# EasyEDA Pro project ProPrj_逆变电路（单相三相）_2026-01-25.epro, board PCB1_2
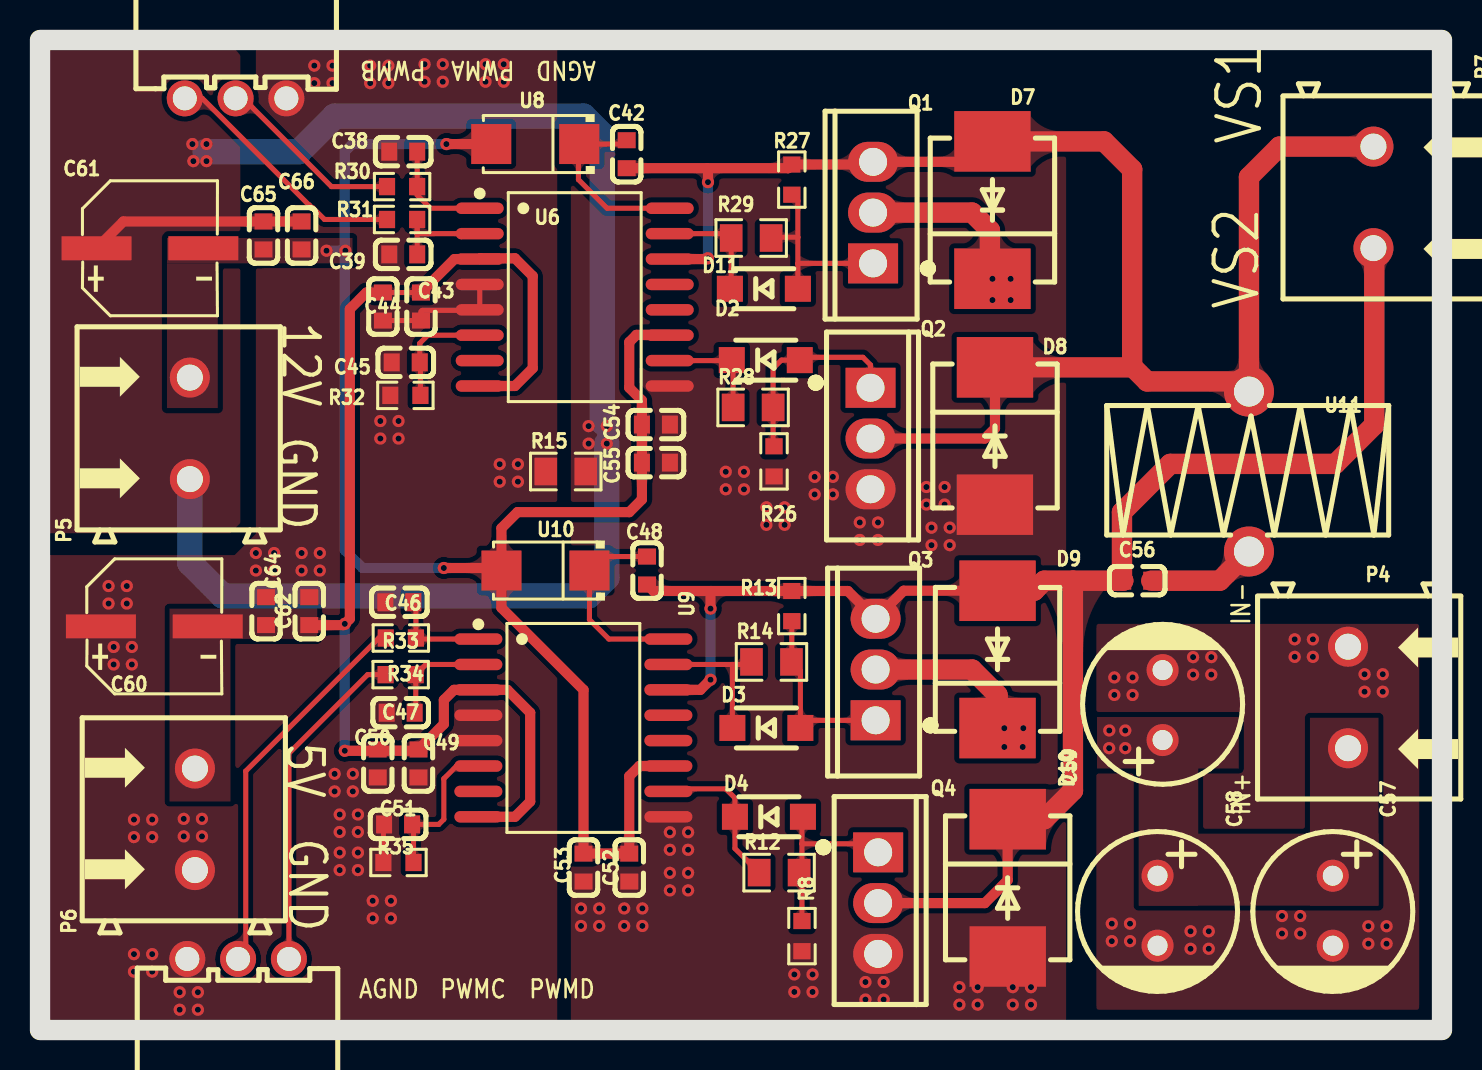
[diagram p7: board, top side]
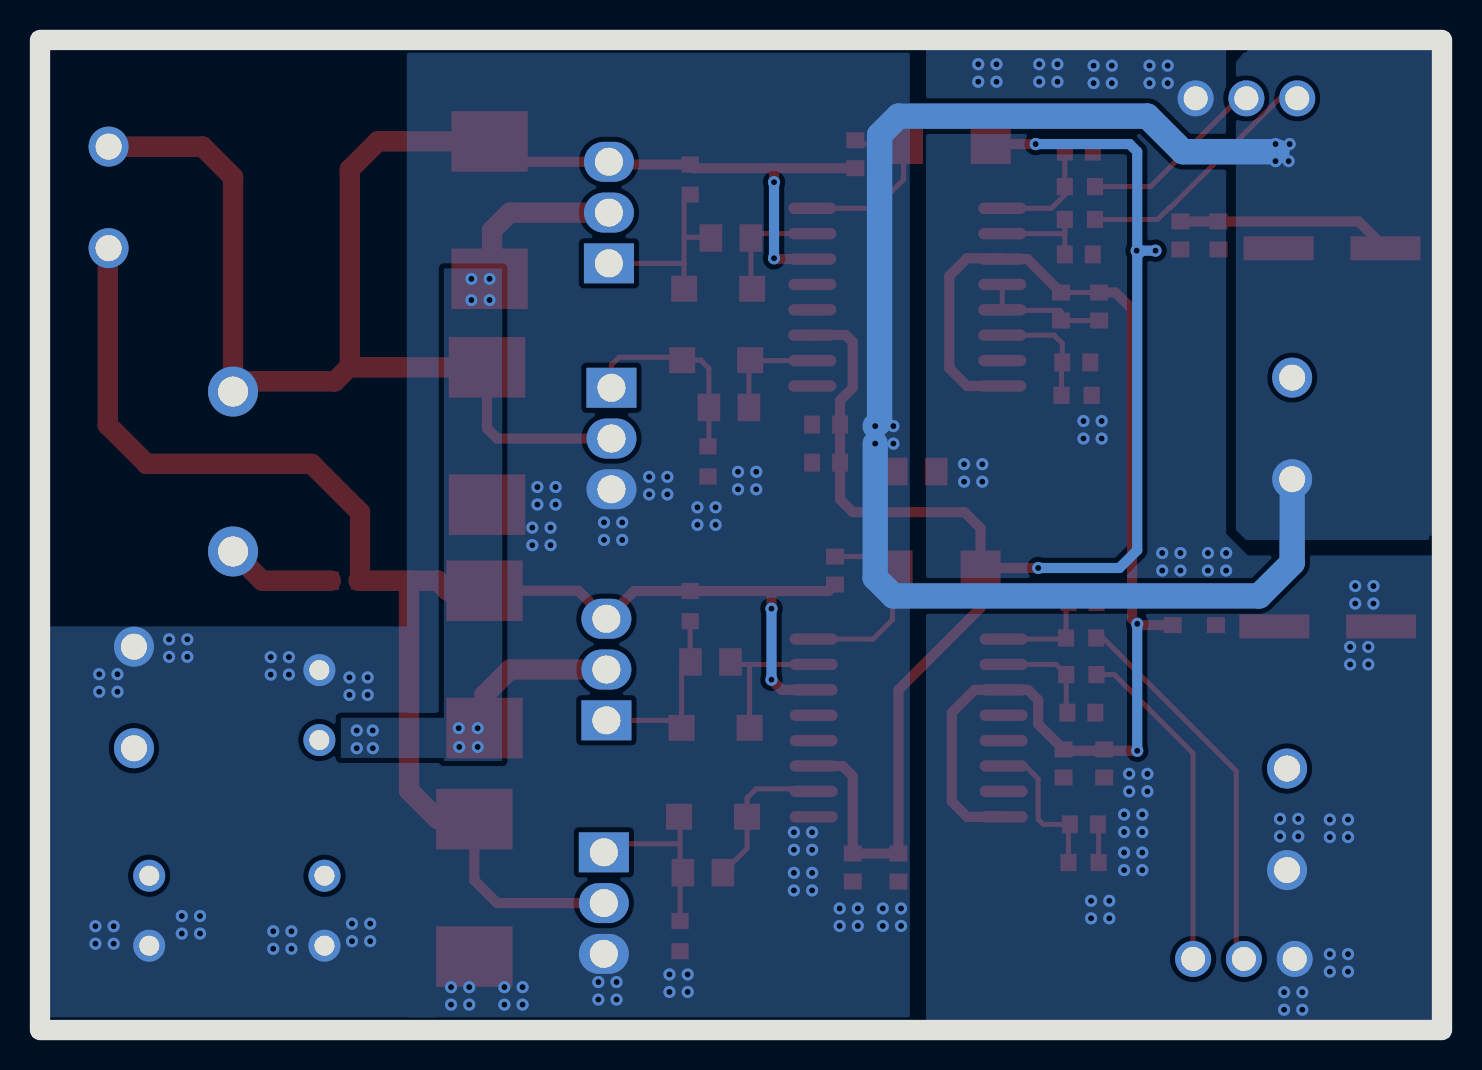
[diagram p8: board, bottom side, seen from below]

Outline 70.1 x 49.53 mm; copper layers: Top Layer, Bottom Layer. Coordinates in mm from the lower left corner of the outline.
Outline path: rectangle 0,49.53 70.1,0
Stack: Top Layer 0.035mm / Dielectric1 1.51mm FR4 er 4.5 / Bottom Layer 0.035mm

## Design rules (mm)
template: 自定义配置
spacing copperThickness1oz (default): track to track 0.102, other pairs 0.152 to 0.3
spacing copperThickness2oz: track to track 0.203, other pairs 0.152 to 0.3
track width copperThickness1oz (default): min 0.127, default 0.254, max 2.54
track width copperThickness2oz: min 0.203, default 0.254, max 2.54
differential pair differentialPair (default): width min 0.127, default 0.254, max 2.54; gap min 0.152, default 0.152
via viaSize (default): diameter min 0.5, default 0.61, max 10; hole min 0.3, default 0.305, max 6.3

## Placement (name value [footprint] x y rotation side)
C38  33pF  [C0603]  18.16 43.94 180 top
C39  33pF  [C0603]  18.16 38.8 180 top
C42  1uF  [C0603]  29.34 43.81 90 top
C43  22pF  [C0603]  19.05 36.19 270 top
C44  100nF  [C0603]  17.14 36.19 270 top
C45  1nF  [C0603]  18.29 33.4 180 top
C46  33pF  [C0603]  17.97 21.4 180 top
C47  33pF  [C0603]  18.03 15.88 180 top
C48  1uF  [C0603]  30.35 22.99 90 top
C49  22pF  [C0603]  18.92 13.33 270 top
C50  100nF  [C0603]  16.89 13.33 270 top
C51  1nF  [C0603]  17.91 10.29 180 top
C52  100nF  [C0603]  29.46 8.13 270 top
C53  1uF  [C0603]  27.18 8.13 270 top
C54  100nF  [C0603]  30.8 30.29 0 top
C55  1uF  [C0603]  30.8 28.38 0 top
C56  100nF  [C0603]  54.86 22.48 0 top
C57  470uF  [CAP-TH_BD8.0-P3.50-D0.6-FD_1]  64.64 5.97 270 top
C58  470uF  [CAP-TH_BD8.0-P3.50-D0.6-FD_1]  55.88 5.97 270 top
C59  470uF  [CAP-TH_BD8.0-P3.50-D0.6-FD_1]  56.13 16.26 90 top
C60  47uF  [CAP-SMD_BD6.3-L6.6-W6.6-FD]  5.71 20.19 0 top
C61  47uF  [CAP-SMD_BD6.3-L6.6-W6.6-FD]  5.5 39.11 0 top
C62  100nF  [C0603]  13.46 20.95 270 top
C64  1uF  [C0603]  11.3 20.95 270 top
C65  100nF  [C0603]  11.18 39.75 270 top
C66  1uF  [C0603]  13.08 39.75 270 top
CN2  XH-3AW  [CONN-TH_3P-P2.54_HCTL_XH-3AW]  9.78 46.61 0 top
CN3  XH-3AW  [CONN-TH_3P-P2.54_HCTL_XH-3AW]  9.91 3.56 180 top
D2  1N4148W  [SOD-123FL_L2.6-W1.6-LS3.4-RD]  36.29 33.51 0 top
D3  1N4148W  [SOD-123FL_L2.6-W1.6-LS3.4-RD]  36.32 15.11 0 top
D4  1N4148W  [SOD-123FL_L2.6-W1.6-LS3.4-RD]  36.45 10.67 0 top
D7  SS510  [SMC_L7.1-W6.2-LS8.1-R-RD]  47.62 41.02 90 top
D8  SS510  [SMC_L7.1-W6.2-LS8.1-R-RD]  47.75 29.72 270 top
D9  SS510  [SMC_L7.1-W6.2-LS8.1-R-RD]  47.88 18.54 90 top
D10  SS510  [SMC_L7.1-W6.2-LS8.1-R-RD]  48.39 7.11 270 top
D11  1N4148W  [SOD-123FL_L2.6-W1.6-LS3.4-RD]  36.19 37.08 0 top
P4  WJ500V-5.08-2P  [CONN-TH_2P-P5.00_WJ500V-5.08-2P]  65.41 16.64 270 top
P5  WJ500V-5.08-2P  [CONN-TH_2P-P5.00_WJ500V-5.08-2P]  7.49 30.1 90 top
P6  WJ500V-5.08-2P  [CONN-TH_2P-P5.00_WJ500V-5.08-2P]  7.75 10.54 90 top
P7  WJ500V-5.08-2P  [CONN-TH_2P-P5.00_WJ500V-5.08-2P]  66.67 41.66 270 top
Q1  IRF540  [TO-220AB-3_L10.4-W4.6-P2.54-L]  41.66 40.89 90 top
Q2  IRF540  [TO-220AB-3_L10.4-W4.6-P2.54-L]  41.53 29.59 270 top
Q3  IRF540  [TO-220AB-3_L10.4-W4.6-P2.54-L]  41.78 18.03 90 top
Q4  IRF540  [TO-220AB-3_L10.4-W4.6-P2.54-L]  41.91 6.35 270 top
R8  10K  [R0603]  38.1 4.7 90 top
R12  10  [R0805]  36.96 7.87 0 top
R13  10K  [R0603]  37.59 21.21 270 top
R14  10  [R0805]  36.58 18.41 0 top
R15  0  [R0805]  26.29 27.94 0 top
R26  10K  [R0603]  36.7 28.45 90 top
R27  10K  [R0603]  37.59 42.55 270 top
R28  10  [R0805]  35.66 31.15 0 top
R29  10  [R0805]  35.56 39.62 0 top
R30  51  [R0603]  18.11 42.2 0 top
R31  51  [R0603]  18.11 40.55 0 top
R32  10K  [R0603]  18.27 31.75 180 top
R33  51  [R0603]  18.04 19.61 0 top
R34  51  [R0603]  18.03 17.78 0 top
R35  10K  [R0603]  17.92 8.38 180 top
U6  UCC21520DWR  [SOIC-16_L10.3-W7.5-P1.27-LS10.3-BL]  26.74 36.66 270 top
U8  1N4007  [SMA_L4.3-W2.6-LS5.1-RD]  24.76 44.32 180 top
U9  UCC21520DWR  [SOIC-16_L10.3-W7.5-P1.27-LS10.3-BL]  26.67 15.11 270 top
U10  1N4007  [SMA_L4.3-W2.6-LS5.1-RD]  25.27 22.99 180 top
U11  22uH  [IND-TH_L14.0-W6.5-P8.00-D0.6]  60.45 27.94 270 top

## Footprints (pads in the part's own frame, mm; a bottom-side part is the same pattern mirrored in y, then rotated)
C0603
  rect 0.8x0.9 smd: 1(-0.7,0) 2(0.7,0)
CAP-SMD_BD6.3-L6.6-W6.6-FD
  rect 3.5x1.2 smd: 1(-2.67,0) 2(2.67,0)
CAP-TH_BD8.0-P3.50-D0.6-FD_1
  round 1.6 hole 1: 1(-1.75,0) 2(1.75,0)
CONN-TH_2P-P5.00_WJ500V-5.08-2P
  round 2 hole 1.3: 1(-2.54,0) 2(2.54,0)
CONN-TH_3P-P2.54_HCTL_XH-3AW
  round 1.8 hole 1.199: 1(-2.54,0) 2(0.002,0) 3(2.54,0)
IND-TH_L14.0-W6.5-P8.00-D0.6
  round 2.5 hole 1.5: 1(-4,0) 2(4,0)
R0603
  rect 0.806x0.864 smd: 1(-0.753,0) 2(0.753,0)
R0805
  rect 1.133x1.377 smd: 1(-1,0) 2(1,0)
SMA_L4.3-W2.6-LS5.1-RD
  rect 2x2 smd: 1(-2.2,0) 2(2.2,0)
SMC_L7.1-W6.2-LS8.1-R-RD
  rect 3.03x3.82 smd: 1(3.435,0) 2(-3.435,0)
SOD-123FL_L2.6-W1.6-LS3.4-RD
  rect 1.3x1.3 smd: 1(-1.7,0) 2(1.7,0)
SOIC-16_L10.3-W7.5-P1.27-LS10.3-BL
  oval 0.574x2.401 smd: 1(-4.445,-4.75) 2(-3.175,-4.75) 3(-1.905,-4.75) 4(-0.635,-4.75) 5(0.635,-4.75) 6(1.905,-4.75) 7(3.175,-4.75) 8(4.445,-4.75) 9(4.445,4.75) 10(3.175,4.75) 11(1.905,4.75) 12(0.635,4.75) 13(-0.635,4.75) 14(-1.905,4.75) 15(-3.175,4.75) 16(-4.445,4.75)
TO-220AB-3_L10.4-W4.6-P2.54-L
  rect 2x2.5 hole 1.4: 1(-2.54,0)
  oval 2x2.5 hole 1.4: 2(0,0) 3(2.54,0)

## Nets
As in the schematic.

Pads without a net: U6 7 12 13; U9 7 12 13

## Via types
v1: diameter 0.61, hole 0.305, Top Layer to Bottom Layer, 190 vias

## Routing (per net, layer and track width the routed paths; a pad name or vN(x,y) marks a point on that pad's centre or on a via; arc(x,y) is an arc through that point)
+5V: length 61.3
  Top Layer w0.254: C43.1 C44.1
  Top Layer w0.508: C62.2 15.17,20.25 v1(15.24,20.32) 15.49,20.57 15.49,36.07 16.32,36.89 C44.1 ; U9.8 23.75,10.67 24.51,11.43 24.51,15.88 23.37,17.02 U9.3 20.7,17.02 20.19,16.51 20.19,15.3 C49.1 18.86,13.97 v1(15.24,13.97) ; U6.8 23.75,32.22 24.64,33.11 24.64,37.72 23.75,38.61 22.03,38.61 U6.3 20.72,38.57 C43.1
  Bottom Layer w0.508: v1(15.24,20.32) v1(15.24,13.97)
+12V: length 80.9
  Top Layer w0.508: U10.2 23.07,25.1 23.88,25.91 29.46,25.91 30.1,26.54 C55.1 C54.1 30.1,31.5 29.46,32.13 29.46,34.42 29.82,34.78 31.47,34.78 U6.11 ; U10.2 22.95,23.11 v1(20.19,23.11) ; U10.2 23.07,21.12 27.18,17.02 C53.1 C52.1 29.46,12.7 29.97,13.21 U9.11 ; v1(20.32,44.32) U8.2
  Bottom Layer w0.508: 14.99,38.99 15.24,38.73 15.24,24 16.13,23.11 v1(20.19,23.11) ; 14.99,38.99 15.11,38.99 15.24,39.12 15.24,43.94 15.62,44.32 v1(20.32,44.32) ; 14.99,38.99 v1(14.33,38.99)
  vias: v1(15.27,38.99)
AGND: length 8.5
  Top Layer w0.254: C51.2 17.17,10.25 R35.2 ; C44.2 C43.2 19.05,35.94 19.11,36 21.07,36 21.1,36.03 U6.5 U6.4
  vias: v1(3.43,22.21) v1(3.43,21.34) v1(3.68,19.16) v1(3.68,18.29) v1(4.34,22.21) v1(4.34,21.34) v1(4.59,19.16) v1(4.59,18.29) v1(4.7,10.53) v1(4.7,9.65) v1(4.7,3.8) v1(4.7,2.92) v1(5.61,10.53) v1(5.61,9.65) v1(5.61,3.8) v1(5.61,2.92) v1(6.98,1.89) v1(6.98,1.02) v1(7.19,10.56) v1(7.19,9.69) v1(7.9,1.89) v1(7.9,1.02) v1(8.1,10.56) v1(8.1,9.69) v1(10.79,23.86) v1(10.79,22.99) v1(11.71,23.86) v1(11.71,22.99) v1(13.08,23.86) v1(13.08,22.99) v1(13.72,48.25) v1(13.72,47.37) v1(13.99,23.86) v1(13.99,22.99) v1(14.63,48.25) v1(14.63,47.37) v1(14.73,12.81) v1(14.73,11.94) v1(14.99,10.78) v1(14.99,9.91) v1(14.99,8.88) v1(14.99,8) v1(15.64,12.81) v1(15.64,11.94) v1(15.9,10.78) v1(15.9,9.91) v1(15.9,8.88) v1(15.9,8) v1(16.51,48.25) v1(16.51,47.37) v1(16.64,6.46) v1(16.64,5.59) v1(17.02,30.47) v1(17.02,29.59) v1(17.42,48.25) v1(17.42,47.37) v1(17.55,6.46) v1(17.55,5.59) v1(17.93,30.47) v1(17.93,29.59) v1(19.23,48.32) v1(19.23,47.44) v1(20.14,48.32) v1(20.14,47.44) v1(22.28,48.32) v1(22.28,47.44) v1(22.99,28.31) v1(22.99,27.43) v1(23.19,48.32) v1(23.19,47.44) v1(23.9,28.31) v1(23.9,27.43)
GND: length 80.1
  Top Layer w0.508: C61.1 4.17,40.45 C65.1 C66.1
  Bottom Layer w0.254: v1(28.34,29.34) v1(28.34,30.21)
  Bottom Layer w1.27: 7.49,27.56 7.49,23.37 9.14,21.72 27.43,21.72 28.34,22.63 v1(28.34,29.34) ; 8.25,43.94 12.95,43.94 14.73,45.72 27.18,45.72 28.12,44.78 28.12,30.44 v1(28.34,30.21)
  vias: v1(7.62,44.32) v1(7.67,43.47) v1(8.32,44.32) v1(8.32,43.47) v1(27.05,6.08) v1(27.05,5.21) v1(27.43,30.21) v1(27.43,29.34) v1(27.96,6.08) v1(27.96,5.21) v1(29.21,6.08) v1(29.21,5.21) v1(30.12,6.08) v1(30.12,5.21) v1(31.5,9.89) v1(31.5,9.02) v1(31.5,7.86) v1(31.5,6.98) v1(32.41,9.89) v1(32.41,9.02) v1(32.41,7.86) v1(32.41,6.98) v1(34.29,27.93) v1(34.29,27.05) v1(35.2,27.93) v1(35.2,27.05) v1(36.32,26.15) v1(36.32,25.27) v1(37.23,26.15) v1(37.23,25.27) v1(37.72,2.78) v1(37.72,1.91) v1(38.63,2.78) v1(38.63,1.91) v1(38.73,27.67) v1(38.73,26.8) v1(39.65,27.67) v1(39.65,26.8) v1(40.99,25.39) v1(40.99,24.52) v1(41.28,2.4) v1(41.28,1.52) v1(41.9,25.39) v1(41.9,24.52) v1(42.19,2.4) v1(42.19,1.52) v1(44.32,27.16) v1(44.32,26.29) v1(44.58,25.13) v1(44.58,24.26) v1(45.23,27.16) v1(45.23,26.29) v1(45.49,25.13) v1(45.49,24.26) v1(45.97,2.15) v1(45.97,1.27) v1(46.88,2.15) v1(46.88,1.27) v1(48.64,2.15) v1(48.64,1.27) v1(49.55,2.15) v1(49.55,1.27) v1(53.59,5.32) v1(53.59,4.44) v1(53.72,17.64) v1(53.72,16.76) v1(54.5,5.32) v1(54.5,4.44) v1(54.63,17.64) v1(54.63,16.76) v1(57.53,4.94) v1(57.53,4.06) v1(57.66,18.66) v1(57.66,17.78) v1(58.44,4.94) v1(58.44,4.06) v1(58.57,18.66) v1(58.57,17.78) v1(62.1,5.7) v1(62.1,4.83) v1(62.74,19.55) v1(62.74,18.67) v1(63.01,5.7) v1(63.01,4.83) v1(63.65,19.55) v1(63.65,18.67) v1(66.23,17.8) v1(66.23,16.92) v1(66.42,5.19) v1(66.42,4.32) v1(67.14,17.8) v1(67.14,16.92) v1(67.33,5.19) v1(67.33,4.32)
IN+: length 17
  Top Layer w1.016: Q3.2 46.61,18.03 47.88,16.76 D9.2 ; D7.2 47.5,37.71 47.5,40 46.61,40.89 Q1.2
  vias: v1(47.62,37.58) v1(47.62,36.52) v1(48.22,15.1) v1(48.22,14.16) v1(48.53,37.58) v1(48.53,36.52) v1(49.14,14.16) v1(49.17,15.1) v1(53.47,14.99) v1(53.46,14.1) v1(54.27,14.99) v1(54.27,14.1)
OUTA1: length 5.7
  Top Layer w0.254: U6.15 34.34,39.84 R29.1 34.56,37.15 D11.1
OUTA2: length 7.4
  Top Layer w0.254: 34.6,18.29 35.45,18.29 R14.1 ; 34.6,18.29 34.62,18.27 D3.1 ; 34.6,18.29 U9.15
OUTB1: length 5.5
  Top Layer w0.254: U6.10 34.57,33.49 34.59,33.51 34.66,33.45 R28.1
OUTB2: length 7.8
  Top Layer w0.254: U9.10 31.55,12.06 34.29,12.06 34.75,11.61 D4.1 34.75,9.08 R12.1
PWMA: length 9.4
  Top Layer w0.254: CN2.2 10.16,46.61 14.57,42.2 R30.1
PWMB: length 12.6
  Top Layer w0.254: R31.1 14.23,40.55 13.65,41.13 13.61,41.13 13.46,41.27 13.45,41.27 8.11,46.61 CN2.1
PWMC: length 19.3
  Top Layer w0.254: CN3.2 10.29,3.94 10.29,12.95 16.94,19.61 R33.1
PWMD: length 16.8
  Top Layer w0.254: CN3.1 12.45,13.84 16.38,17.78 R34.1
VS1: length 83.1
  Top Layer w0.508: D7.1 46.6,43.43 Q1.3 41.52,43.3 R27.1 37.41,43.11 33.36,43.11 ; v1(33.4,38.61) 33.36,38.57 U6.14 ; 33.36,43.11 C42.1 ; 33.36,43.11 33.4,43.08 v1(33.4,42.42) ; Q2.2 47.24,29.59 47.75,30.1 47.75,33.15
  Top Layer w1.016: D7.1 53.21,44.46 54.61,43.05 54.61,33.2 54.65,33.15 ; 54.65,33.15 47.75,33.15 ; 54.65,33.15 55.36,32.45 59.94,32.45 U11.1 60.45,42.67 61.97,44.2 P7.1
  Bottom Layer w0.508: v1(33.4,38.61) v1(33.4,42.42)
VS2: length 83.2
  Top Layer w0.508: v1(33.53,17.53) 33.02,17.02 U9.14 ; 33.55,21.96 33.53,21.94 v1(33.53,21.08) ; 33.55,21.96 30.68,21.96 C48.1 ; 33.55,21.96 R13.1 40.39,21.96 Q3.3 43.19,21.98 47.88,21.98 ; Q4.2 47.24,6.35 48.39,7.49 D10.2
  Top Layer w1.016: 51.65,22.48 54.16,22.48 54.1,22.54 54.1,25.91 56.51,28.32 64.77,28.32 66.72,30.27 66.72,39.08 P7.2 ; 51.65,22.48 50.21,22.48 49.71,21.98 47.88,21.98 ; 51.65,22.48 51.65,11.98 50.22,10.55 D10.2
  Bottom Layer w0.508: v1(33.53,17.53) v1(33.53,21.08)
$1N3008: length 9.2
  Top Layer w0.254: R8.2 38.1,9.32 ; 38.1,9.32 38.1,10.62 D4.2 ; 38.1,9.32 41.48,9.32 Q4.1
$1N3011: length 9.5
  Top Layer w0.254: R13.2 37.59,18.43 R14.2 38.02,17.97 D3.2 38.4,15.49 Q3.1
$1N3020: length 10.3
  Top Layer w0.254: Q2.1 41.53,33.27 41.15,33.66 38.13,33.66 D2.2 37.07,33.51 36.66,33.1 R28.2 36.66,29.25 R26.2
$1N3021: length 9.9
  Top Layer w0.254: R29.2 36.6,39.66 37.89,39.66 ; 37.89,39.66 37.89,38.35 ; 37.89,39.66 37.89,41.49 R27.2 ; 37.89,38.35 37.9,38.35 Q1.1 ; 37.89,38.35 D11.2
$1N3645: length 5.6
  Top Layer w0.254: U6.1 19.53,41.11 18.86,41.78 R30.2 18.86,42.2 C38.1
$1N3671: length 5.6
  Top Layer w0.254: U6.2 18.86,39.84 ; 18.86,39.84 18.86,40.55 R31.2 18.86,39.84 ; 18.86,39.84 C39.1
$1N3989: length 9.4
  Top Layer w0.254: C42.2 29.14,44.32 U8.1 26.92,44.28 26.92,42.55 28.36,41.11 U6.16
$1N4175: length 5.8
  Top Layer w0.254: R32.1 19.02,33.36 C45.1 18.99,34.35 19.39,34.76 U6.6
$1N5130: length 5
  Top Layer w0.254: C46.1 18.8,21.27 R33.2 18.85,19.56 U9.1
$1N5132: length 5.3
  Top Layer w0.254: C47.1 18.79,15.93 R34.2 19.3,18.29 U9.2
$1N5148: length 10
  Top Layer w0.254: U9.16 28.45,19.56 27.47,20.53 U10.1 28.17,23.69 C48.2
$1N5162: length 7.6
  Top Layer w0.254: 18.68,8.38 18.68,10.22 C51.1 19.94,10.29 20.19,10.54 20.19,12.57 20.83,13.21 U9.6
$1N6990: length 5.5
  Top Layer w1.016: C56.2 58.99,22.48 U11.2

## Copper pours and planes (outline as drawn; the poured copper is in the pictures)
+5V on Top Layer: 6.48,19.56 9.52,19.56 9.52,11.43 6.48,11.43
+5V on Top Layer: 6.48,21.08 13.86,21.08 13.86,19.56 6.48,19.56
+12V on Top Layer: 6.35,38.35 8.89,38.35 8.89,31.11 6.35,31.11
+12V on Top Layer: 6.35,39.62 15.62,39.62 15.62,38.35 6.35,38.35
AGND on Top Layer: 11.11,49.53 11.11,24.83 10.03,23.75 0.27,23.75 0.27,0.15 0.13,0 25.86,0 25.86,49.45 25.78,49.53
AGND on Top Layer: 11.04,49.53 11.04,24.83 9.96,23.75 0.2,23.75 0.2,0.15 0.05,0 25.79,0 25.79,49.45 25.71,49.53
AGND on Top Layer: 10.79,49.53 10.79,24.83 9.71,23.75 -0.05,23.75 -0.05,0.15 -0.19,0 25.54,0 25.54,49.45 25.46,49.53
AGND on Bottom Layer: 10.79,49.53 10.79,24.83 9.71,23.75 -0.05,23.75 -0.05,0.15 -0.19,0 25.8,0 25.8,49.19 25.46,49.53
GND on Top Layer: 52.83,20.19 68.96,20.19 68.96,1.02 52.83,1.02
GND on Top Layer: 26.54,48.64 51.31,48.64 51.31,0.38 26.54,0.38
GND on Top Layer: 0.34,49.07 0.34,24.85 9.51,24.85 10.02,25.36 10.02,48.76 9.62,49.24 0.56,49.24
GND on Top Layer: 52.83,20.32 68.96,20.32 68.96,1.14 52.83,1.14
GND on Bottom Layer: 50.29,20.19 69.98,20.19 69.98,0.63 50.29,0.63
GND on Bottom Layer: 0.63,48.73 0.63,24.51 9.8,24.51 10.31,25.02 10.31,48.42 9.91,48.9 0.85,48.9
GND on Bottom Layer: 7.11,44.83 8.76,44.83 8.76,43.05 7.11,43.05
GND on Bottom Layer: 26.61,48.89 51.76,48.89 51.76,0.63 26.61,0.63
GND on Bottom Layer: 0.34,48.95 0.34,24.72 9.51,24.72 10.02,25.23 10.02,48.63 9.62,49.12 0.56,49.12
IN+ on Top Layer: 63.5,15.62 66.93,15.62 66.93,6.22 63.5,6.22
IN+ on Top Layer: 52.85,15.66 59.94,15.66 59.94,13.08 52.85,13.08
IN+ on Top Layer: 54.93,15.66 57.91,15.66 57.91,6.22 54.93,6.22
IN+ on Top Layer: 54.95,9.82 66.93,9.82 66.93,6.22 54.95,6.22
IN+ on Bottom Layer: 46.99,38.1 49.91,38.1 49.91,13.46 46.99,13.46
IN+ on Bottom Layer: 47.5,15.62 55.06,15.62 55.06,13.61 47.5,13.61

Small or netless copper shapes (teardrops, artwork), in the pictures only: 164 on Top Layer, 14 on Bottom Layer

## Text on the board
Top Silkscreen Layer: AGND | PWMC | PWMD | IN- | IN+ | PWMB | PWMA | GND | 12V | 5V | VS2 | VS1
